# Altium project SharkPup.PrjPcb
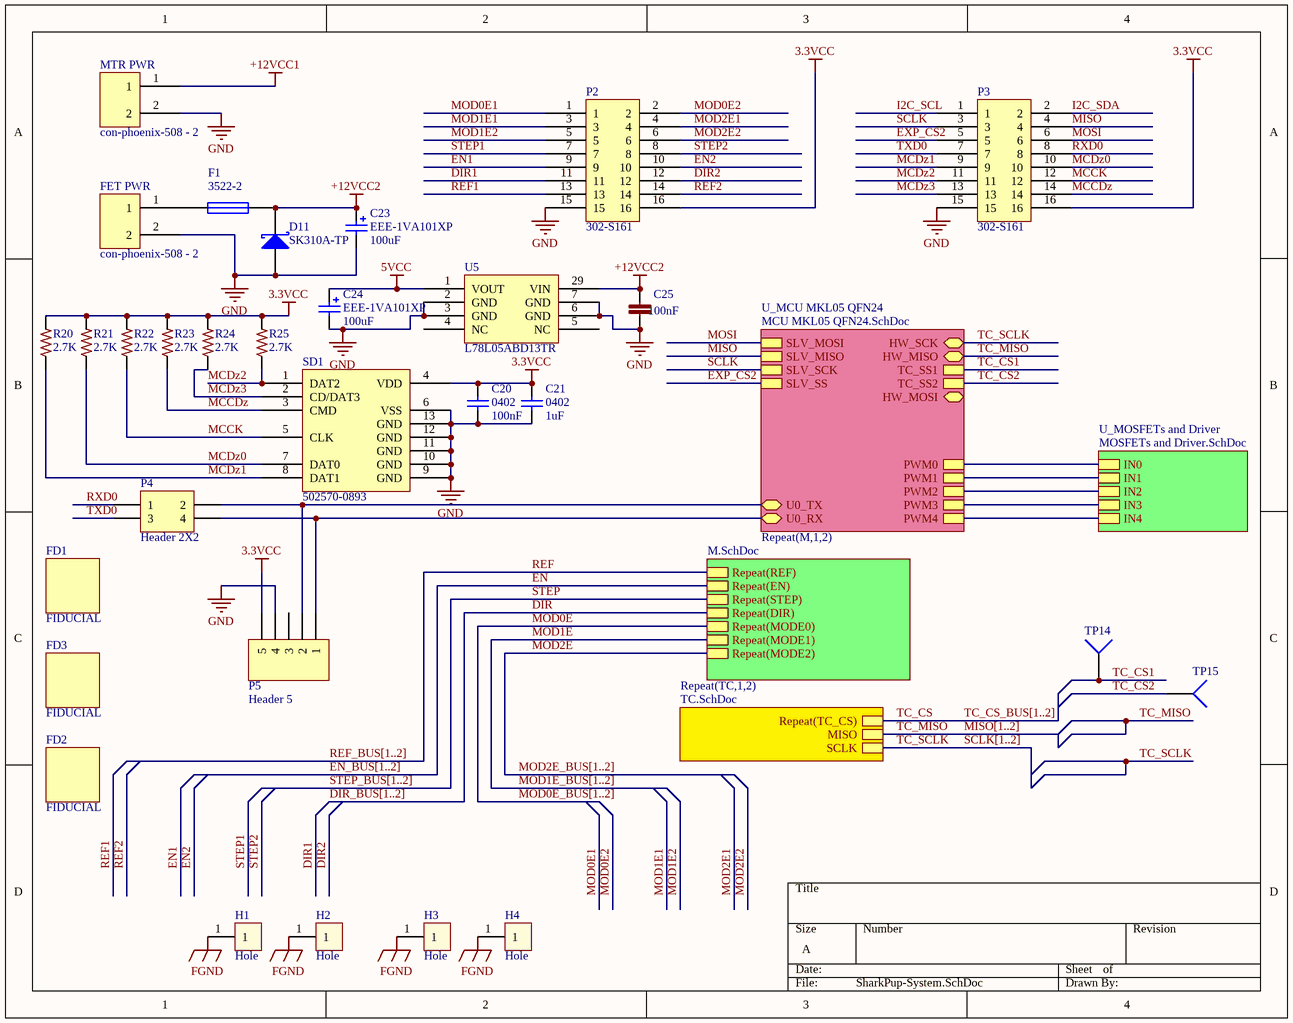
[diagram p0: SharkPup-System.SchDoc]
5 sheets, 136 parts. Net scope: hierarchical (ports join the sheet entries above them; power ports are global).
Sheets:
  SharkPup-System.SchDoc
    M1 = M.SchDoc
    M2 = M.SchDoc
    TC1 = TC.SchDoc
    TC2 = TC.SchDoc
    U_MOSFETs and Driver = MOSFETs and Driver.SchDoc
    U_MCU MKL05 QFN24 = MCU MKL05 QFN24.SchDoc

## Sheet SharkPup-System.SchDoc
size A

### Parts
C20  value 100nF  [C0402]  (hidden comment: 0402)
C21  value 1uF  [C0402]  (hidden comment: 0402)
C23  EEE-1VA101XP  value 100uF  [EEE-1VA101XP]
C24  EEE-1VA101XP  value 100uF  [EEE-1VA101XP]
C25  100nF  [C0603]
D11  SK310A-TP  [SK310A-TP]
F1  3522-2  [3522-2 - WAVE SOLDER]
FD1  FIDUCIAL  [FIDUCIAL-1X2]
FD2  FIDUCIAL  [FIDUCIAL-1X2]
FD3  FIDUCIAL  [FIDUCIAL-1X2]
FET_PWR  con-phoenix-508 - 2  [MSTBV2 - duplicate]
H1  Hole  [Wave_hole_3x7-singleSided]  (no BOM)
H2  Hole  [Wave_hole_3x7-singleSided]  (no BOM)
H3  Hole  [Wave_hole_3x7-singleSided]  (no BOM)
H4  Hole  [Wave_hole_3x7-singleSided]  (no BOM)
MTR_PWR  con-phoenix-508 - 2  [MSTBV2 - duplicate]
P2  302-S161  [302-S161]
P3  302-S161  [302-S161]
P4  Header 2X2  [HDR2X2]
P5  Header 5  [HDR1X5]
R20  2.7K  [R0402]
R21  2.7K  [R0402]
R22  2.7K  [R0402]
R23  2.7K  [R0402]
R24  2.7K  [R0402]
R25  2.7K  [R0402]
SD1  502570-0893  [502570-0893 - Molex SD]
TP14  TP4  [TP-2]  (value not drawn)
TP15  TP4  [TP-2]  (value not drawn)
U5  L78L05ABD13TR  [L78L05ABD13TR]

### Sub-sheets
Repeat(M,1,2) = M.SchDoc: Repeat(REF), Repeat(EN), Repeat(STEP), Repeat(DIR), Repeat(MODE0), Repeat(MODE1), Repeat(MODE2)
Repeat(TC,1,2) = TC.SchDoc: SCLK, MISO, Repeat(TC_CS)
U_MCU MKL05 QFN24 = MCU MKL05 QFN24.SchDoc: TC_SS1, TC_SS2, SLV_MOSI, SLV_MISO, SLV_SCK, SLV_SS, PWM4, PWM3, PWM2, PWM1, PWM0, HW_MISO, HW_MOSI, HW_SCK, U0_TX, U0_RX
U_MOSFETs and Driver = MOSFETs and Driver.SchDoc: IN0, IN1, IN2, IN3, IN4

### Nets
3.3VCC: C20.2 C21.2 P2.16 P3.16 P5.5 R20.2 R21.2 R22.2 R23.2 R24.2 R25.2 SD1.4(VDD)
5VCC: C24.1 U5.1(VOUT)
+12VCC1: MTR_PWR.1
+12VCC2: C23.1 C25.1 D11.2(K) F1.2 U5.29(VIN)
FGND: H1.1 H2.1 H3.1 H4.1
GND: C20.1 C21.1 C23.2 C24.2 C25.2 D11.1(A) FET_PWR.2 MTR_PWR.2 P2.15 P3.15 P5.4 SD1.6(VSS) SD1.9(GND) SD1.10(GND) SD1.11(GND) SD1.12(GND) SD1.13(GND) U5.2(GND) U5.3(GND) U5.6(GND) U5.7(GND)
DIR: sheet Repeat(M,1,2)/Repeat(DIR)
DIR1: P2.11
DIR2: P2.12
EN: sheet Repeat(M,1,2)/Repeat(EN)
EN1: P2.9
EN2: P2.10
EXP_CS2: P3.5 ; sheet U_MCU MKL05 QFN24/SLV_SS
I2C_SCL: P3.1
I2C_SDA: P3.2
MCCDz: P3.14 R23.1 SD1.3(CMD)
MCCK: P3.12 R22.1 SD1.5(CLK)
MCDz0: P3.10 R21.1 SD1.7(DAT0)
MCDz1: P3.9 R20.1 SD1.8(DAT1)
MCDz2: P3.11 R25.1 SD1.1(DAT2)
MCDz3: P3.13 R24.1 SD1.2(CD/DAT3)
MISO: P3.4 ; sheet U_MCU MKL05 QFN24/SLV_MISO
MOD0E: sheet Repeat(M,1,2)/Repeat(MODE0)
MOD0E1: P2.1
MOD0E2: P2.2
MOD1E: sheet Repeat(M,1,2)/Repeat(MODE1)
MOD1E1: P2.3
MOD1E2: P2.5
MOD2E: sheet Repeat(M,1,2)/Repeat(MODE2)
MOD2E1: P2.4
MOD2E2: P2.6
MOSI: P3.6 ; sheet U_MCU MKL05 QFN24/SLV_MOSI
PWM0: sheet U_MOSFETs and Driver/IN0, sheet U_MCU MKL05 QFN24/PWM0
PWM1: sheet U_MOSFETs and Driver/IN1, sheet U_MCU MKL05 QFN24/PWM1
PWM2: sheet U_MOSFETs and Driver/IN2, sheet U_MCU MKL05 QFN24/PWM2
PWM3: sheet U_MOSFETs and Driver/IN3, sheet U_MCU MKL05 QFN24/PWM3
PWM4: sheet U_MOSFETs and Driver/IN4, sheet U_MCU MKL05 QFN24/PWM4
REF: sheet Repeat(M,1,2)/Repeat(REF)
REF1: P2.13
REF2: P2.14
RXD0: P3.8 P4.1
SCLK: P3.3 ; sheet U_MCU MKL05 QFN24/SLV_SCK
STEP: sheet Repeat(M,1,2)/Repeat(STEP)
STEP1: P2.7
STEP2: P2.8
TC_CS: sheet Repeat(TC,1,2)/Repeat(TC_CS)
TC_CS1: TP14.1 ; sheet U_MCU MKL05 QFN24/TC_SS1
TC_CS2: TP15.1 ; sheet U_MCU MKL05 QFN24/TC_SS2
TC_MISO: sheet Repeat(TC,1,2)/MISO, sheet U_MCU MKL05 QFN24/HW_MISO
TC_SCLK: sheet Repeat(TC,1,2)/SCLK, sheet U_MCU MKL05 QFN24/HW_SCK
TXD0: P3.7 P4.3
NetF1_1: F1.1 FET_PWR.1
NetP4_2: P4.2 P5.2 ; sheet U_MCU MKL05 QFN24/U0_TX
NetP4_4: P4.4 P5.1 ; sheet U_MCU MKL05 QFN24/U0_RX

Not connected (* = marked no-connect by the designer): P5 3; U5 4(NC) 5(NC) 23(NC)

### Buses and harness runs
bus DIR_BUS[1..2]
bus EN_BUS[1..2]
bus MISO[1..2]
bus MOD0E_BUS[1..2]
bus MOD1E_BUS[1..2]
bus MOD2E_BUS[1..2]
bus REF_BUS[1..2]
bus SCLK[1..2]
bus STEP_BUS[1..2]
bus TC_CS_BUS[1..2]

### Library data of the parts
C20 = GRM155R71C104KA88D: CAP CER 0.1UF (100nF) 16V 10% X7R 0402; MFR: Murata; Part Description: CAP CER 0.1UF 16V 10% X7R 0402; Published: 10 - Dec - 2014; LatestRevisionDate: 10 - Dec - 2014; LatestRevisionNote: Ultimachine Footprint Added; Publisher: Ultimachine; Component Type: Chip Capacitor; MFR Part #: GRM155R71C104KA88D; Mounting Type: SMT 0402; Datasheet: http://psearch.murata.com/capacitor/product/GRM155R71C104KA88%23.pdf; Height: 0.5 ±0.05mm; Tolerance: 10%; Voltage: 16v; PackageReference: 0402
C21 = GRM155R60J105KE19D: CAP CER 1UF 6.3V 10% X5R 0402; MFR: Murata; Voltage: 6.3VDC; Published: 10 - Dec - 2014; LatestRevisionDate: 10 - Dec - 2014; LatestRevisionNote: Ultimachine Footprint Added; Publisher: Ultimachine; Component Type: Chip Capacitor; MFR Part #: GRM155R60J105KE19D; Part Description: CAP CER 1UF 6.3V 10% X5R 0402; Mounting Type: SMT 0402; Datasheet: http://psearch.murata.com/capacitor/product/GRM155R60J105KE19%23.pdf; Height: 0.55mm; Tolerance: 10%; PackageReference: 0402
C23 C24 = EEE-1VA101XP: CAP ALUM 100UF 35V 20% SMD; Manufacture: Panasonic; Digikey Part #: PCE3951CT-ND; Price: $0.63; Mount Type: SMT Panasonic VS D Series; Status: Active; Height: 7.70mm; Datasheet: http://industrial.panasonic.com/www-cgi/jvcr13pz.cgi?E+PZ+3+ABA0002+EEE1VA101XP+7+WW; Manufacture Part #: EEE-1VA101XP
C25 = C0603C104K5RACTU: CAP CER 0603 100nF 50V 10% X7R; LastRevisionNote: ImportComponents; Published: 23-Apr-2014; Publisher: UltiMachine; LastRevisionDate: 23-Apr-2014; ManufacturerPartNumber: C0603C104K5RACTU; VALUE: 100nF
D11 = D Schottky: Schottky Diode; Published: 8-Jun-2000; LatestRevisionDate: 17-Jul-2002; LatestRevisionNote: Re-released for DXP Platform.; PackageReference: SMB; Publisher: Altium Limited; PackageDescription: DO-214-AA/SMB; 2 C-Bend Leads; Body 5.3 x 3.6 mm, inc. leads (LxW); Code_JEDEC: DO-214-AA
F1 = Fuse 1: Fuse; Published: 8-Jun-2000; LatestRevisionDate: 17-Jul-2002; LatestRevisionNote: Re-released for DXP Platform.; PackageReference: PIN-W2/E2.8; Publisher: Altium Limited; PackageDescription: Thru-Hole; 2 Leads
FET_PWR MTR_PWR = con-phoenix-508_2
P2 P3 = 302-S161: 16 Pos 2.54mm Pin Connector Shrouded; Manufacture: On Shore Technology Inc; Value: 2.54mm Pitch Spacing; Manufature Part #: 302-S161; Datasheet: http://www.on-shore.com/sites/default/files/manuals/302-sxxx.pdf; Digikey Part #: ED10522-ND; Pin Count: 16; Type: Throughhole connector; Mount Type: Through hole; Price: $0.40; Height: 9.1mm
P4 = Header 2X2: Header, 2-Pin, Dual row; LatestRevisionDate: 17-Jul-2002; LatestRevisionNote: Re-released for DXP Platform.; Publisher: Altium Limited
P5 = Header 5: Header, 5-Pin; LatestRevisionDate: 17-Jul-2002; LatestRevisionNote: Re-released for DXP Platform.; Publisher: Altium Limited
R20-R25 = ERJ-2RKF2701X: RES SMD 2.7K OHM 1% 1/10W 0402; Manufacturer: Panasonic; ManufacturerPartNumber: ERJ2GEJ105X; LastRevisionNote: ImportComponents; Published: 23-Apr-2014; Publisher: Adam; LastRevisionDate: 23-Apr-2014; VALUE: 2.7K
SD1 = 502570-0893: microSD 502570-0893 Molex Part
TP14 TP15 = Socket: LatestRevisionDate: 17-Jul-2002; LatestRevisionNote: Re-released for DXP Platform.; Publisher: Altium Limited
U5 = L78L05ABD13TR: IC REG LDO 5V 0.1A 8SO; Manufacturer: ST Microelectronics; Mountining Type: SOIC8; Voltage: 30V; Cost (1000 qty): $0.44; Manfacture Part Number: L78L05ABD13TR; Status: In-Production; Pins: 28 Pins and one Exposed Pad; Datasheet: http://www.st.com/web/en/resource/technical/document/datasheet/CD00000446.pdf; Height: 1.2mm; Tolerance: N/A; Type: 5V 100mA LDO; Lead Free: YES

## Sheet M.SchDoc
size A
Used 2 times, as channels M1, M2. Parts and nets are listed once, with the designators drawn on the sheet.
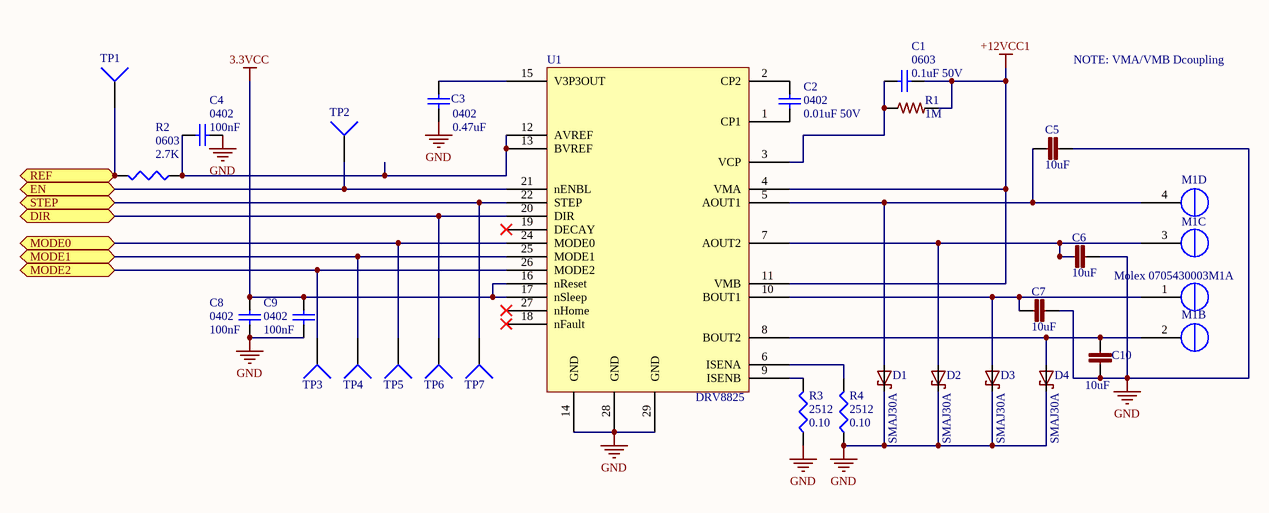
[diagram p1: M.SchDoc]

### Parts
C1  0603  value 0.1uF 50V  [1608[0603]]
C2  value 0.01uF 50V  [C0402]  (hidden comment: 0402)
C3  value 0.47uF  [C0402]  (hidden comment: 0402)
C4  value 100nF  [C0402]  (hidden comment: 0402)
C5  10uF  [C0603]
C6  10uF  [C0603]
C7  10uF  [C0603]
C8  value 100nF  [C0402]  (hidden comment: 0402)
C9  value 100nF  [C0402]  (hidden comment: 0402)
C10  10uF  [C0603]
D1  SMAJ30A  [SMA-SM]
D2  SMAJ30A  [SMA-SM]
D3  SMAJ30A  [SMA-SM]
D4  SMAJ30A  [SMA-SM]
M1  Molex 0705430003  [4POL254]  (parts A,B,C,D of 4)
R1  1M  [R0402]
R2  0603  value 2.7K  [J1-0603]
R3  2512  value 0.10  [Resistor2512]
R4  2512  value 0.10  [Resistor2512]
TP1  TP4  [TP-2]  (value not drawn)
TP2  TP4  [TP-2]  (value not drawn)
TP3  TP4  [TP-2]  (value not drawn)
TP4  TP4  [TP-2]  (value not drawn)
TP5  TP4  [TP-2]  (value not drawn)
TP6  TP4  [TP-2]  (value not drawn)
TP7  TP4  [TP-2]  (value not drawn)
U1  DRV8825  [DRV8825]

### Ports
DIR, EN, MODE0, MODE1, MODE2, REF, STEP

### Nets
3.3VCC: C8.2 C9.2 U1.16(nReset) U1.17(nSleep)
+12VCC1: C1.1 R1.2 U1.4(VMA) U1.11(VMB)
GND: C3.1 C4.1 C5.2 C6.2 C7.2 C8.1 C9.1 C10.2 D1.C D2.C D3.C D4.C R3.1 R4.1 U1.14(GND) U1.28(GND) U1.29(GND)
DIR: TP6.1 U1.20(DIR) ; port DIR
EN: TP2.1 U1.21(nENBL) ; port EN
MODE0: TP5.1 U1.24(MODE0) ; port MODE0
MODE1: TP4.1 U1.25(MODE1) ; port MODE1
MODE2: TP3.1 U1.26(MODE2) ; port MODE2
REF: R2.2 TP1.1 ; port REF
STEP: TP7.1 U1.22(STEP) ; port STEP
NetC1_2: C1.2 R1.1 U1.3(VCP)
NetC2_1: C2.1 U1.1(CP1)
NetC2_2: C2.2 U1.2(CP2)
NetC3_2: C3.2 U1.15(V3P3OUT)
NetC4_2: C4.2 R2.1 U1.12(AVREF) U1.13(BVREF)
NetC5_1: C5.1 D1.A M1.4(OUT1B) U1.5(AOUT1)
NetC6_1: C6.1 D2.A M1.3(OUT1A) U1.7(AOUT2)
NetC7_1: C7.1 D3.A M1.1(OUT2B) U1.10(BOUT1)
NetC10_1: C10.1 D4.A M1.2(OUT2A) U1.8(BOUT2)
NetR3_2: R3.2 U1.9(ISENB)
NetR4_2: R4.2 U1.6(ISENA)

Not connected (* = marked no-connect by the designer): U1 18(nFault)* 19(DECAY)* 23(NC) 27(nHome)*

### Channels
M1: designators end in _M1; ports DIR=DIR1 EN=EN1 MODE0=MOD0E1 MODE1=MOD1E1 MODE2=MOD2E1 REF=REF1 STEP=STEP1
M2: designators end in _M2; ports DIR=DIR2 EN=EN2 MODE0=MOD0E2 MODE1=MOD1E2 MODE2=MOD2E2 REF=REF2 STEP=STEP2

### Notes on the sheet
- NOTE: VMA/VMB Dcoupling

### Library data of the parts
C1 = Cap Semi: Capacitor (Semiconductor SIM Model); Published: 8-Jun-2000; LatestRevisionDate: 29-May-2009; LatestRevisionNote: IPC-7351 Footprint Added.; PackageReference: C1206; Publisher: Altium Limited; PackageDescription: Chip Capacitor
C2 = GRM155R71H103JA88D: CAP CER 10000PF 50V X7R 0402; MFR: Murata; Tolerance: 10%; Voltage: 6.3VDC; Published: 10 - Dec - 2014; LatestRevisionDate: 10 - Dec - 2014; LatestRevisionNote: Ultimachine Footprint Added; Publisher: Ultimachine; Component Type: Chip Capacitor; MFR Part #: GRM155R71H103JA88D; Part Description: CAP CER 10000PF 50V X7R 0402; Mounting Type: SMT 0402; Datasheet: http://search.murata.co.jp/Ceramy/image/img/A01X/G101/ENG/GRM155R71H103JA88-01.pdf; Height: 0.5 ±0.05mm; Digikey #: 490-7763-1-ND; PackageReference: 0402
C3 = GRM155R60J474KE19D: 0.47uF 6.3v C0402 - GRM155R60J474KE19D; MFR: Murata; Part Description: CAP CER 0.47UF 6.3V 10% X5R 0402; Tolerance: 10%; Voltage: 6.3VDC; Published: 10 - Dec - 2014; LatestRevisionDate: 10 - Dec - 2014; LatestRevisionNote: Ultimachine Footprint Added; Publisher: Ultimachine; Component Type: Chip Capacitor; MFR Part #: GRM155R60J474KE19D; Mounting Type: SMT 0402; Datasheet: http://search.murata.co.jp/Ceramy/image/img/A01X/G101/ENG/GRM155R60J474KE19-01.pdf; Height: 0.5 ±0.05mm; PackageReference: 0402
C4 C8 C9 = 100nF C0402 - GRM155R71C104KA88D: Capacitor (Semiconductor SIM Model); MFR: Murata; Part Description: CAP CER 0.1UF 16V 10% X7R 0402; Tolerance: 10%; Voltage: 16v; Published: 10 - Dec - 2014; LatestRevisionDate: 10 - Dec - 2014; LatestRevisionNote: Ultimachine Footprint Added; Publisher: Ultimachine; Component Type: Chip Capacitor; MFR Part #: GRM155R71C104KA88D; Mounting Type: SMT 0402; Datasheet: http://psearch.murata.com/capacitor/product/GRM155R71C104KA88%23.pdf; Height: 0.5 ±0.05mm; PackageReference: 0402
C5-C7 C10 = CC0603ZRY5V6BB105: CAP CER 0603 1uF 10V Y5V; LastRevisionNote: ImportComponents; Published: 23-Apr-2014; Publisher: UltiMachine; LastRevisionDate: 23-Apr-2014; ManufacturerPartNumber: CC0603ZRY5V6BB105; VALUE: 10uF
D1-D4 = SMAJ30A: DIODE TVS 30V SMA; LastRevisionNote: ImportComponents; Published: 23-Apr-2014; Publisher: UltiMachine; LastRevisionDate: 23-Apr-2014; ManufacturerPartNumber: SMAJ30A
M1 = Molex 0705430003 Alt: Molex 4 Pin Clip Connector
R1 = ERJ2GEJ105X: RES 0402 1M 100mW 5%; LastRevisionNote: ImportComponents; Published: 23-Apr-2014; Publisher: UltiMachine; LastRevisionDate: 23-Apr-2014; ManufacturerPartNumber: ERJ2GEJ105X; VALUE: 1M
R2-R4 = Res3: Resistor; Published: 8-Jun-2000; LatestRevisionDate: 29-May-2009; LatestRevisionNote: IPC-7351 Footprint Added.; PackageReference: J1-0603; Publisher: Altium Limited; PackageDescription: Chip Resistor
TP1-TP7 = Socket: LatestRevisionDate: 17-Jul-2002; LatestRevisionNote: Re-released for DXP Platform.; Publisher: Altium Limited
U1 = DRV8825: DRV8825 Ti Stepper Driver

## Sheet TC.SchDoc
size A
Used 2 times, as channels TC1, TC2. Parts and nets are listed once, with the designators drawn on the sheet.
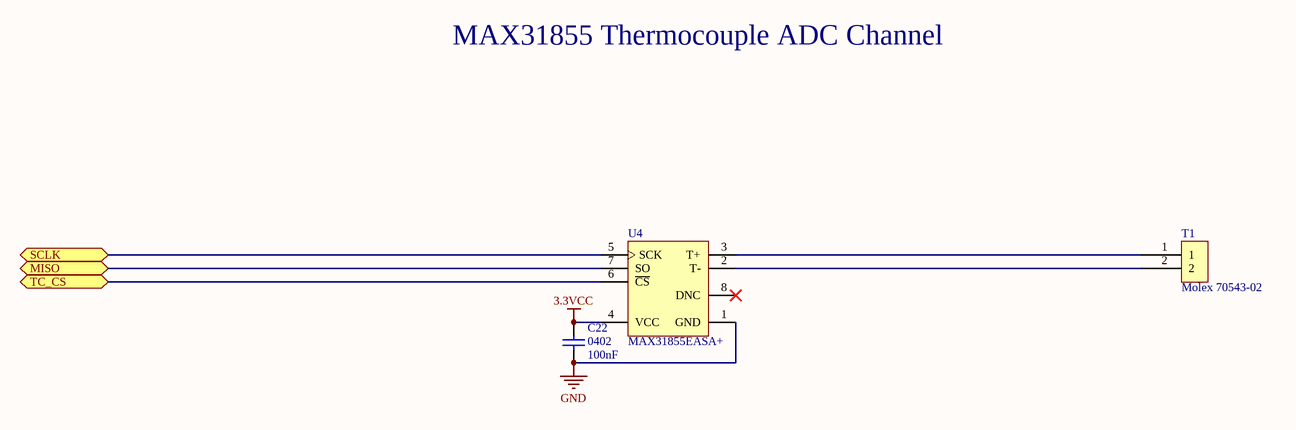
[diagram p2: TC.SchDoc]

### Parts
C22  value 100nF  [C0402]  (hidden comment: 0402)
T1  Molex 70543-02  [70543-02]
U4  MAX31855EASA+  [MAXM-S8+4_N]

### Ports
MISO, SCLK, TC_CS

### Nets
3.3VCC: C22.2 U4.4(VCC)
GND: C22.1 U4.1(GND)
MISO: U4.7(SO) ; port MISO
SCLK: U4.5(SCK) ; port SCLK
TC_CS: U4.6(~{CS}) ; port TC_CS
NetT1_1: T1.1 U4.3(T+)
NetT1_2: T1.2 U4.2(T-)

Not connected (* = marked no-connect by the designer): U4 8(DNC)*

### Channels
TC1: designators end in _TC1; ports MISO=TC_MISO SCLK=TC_SCLK TC_CS=TC_CS1
TC2: designators end in _TC2; ports MISO=TC_MISO SCLK=TC_SCLK TC_CS=TC_CS2

### Notes on the sheet
- MAX31855 Thermocouple ADC Channel

### Library data of the parts
C22 = 100nF C0402 - GRM155R71C104KA88D: as C4 on sheet M; Published: 10 - Dec - 2014; LatestRevisionDate: 10 - Dec - 2014; LatestRevisionNote: Ultimachine Footprint Added; Publisher: Ultimachine; Component Type: Chip Capacitor; MFR Part #: GRM155R71C104KA88D; Mounting Type: SMT 0402; Datasheet: http://psearch.murata.com/capacitor/product/GRM155R71C104KA88%23.pdf; Height: 0.5 ±0.05mm; PackageReference: 0402
U4 = MAX31855EASA+: Cold Junction Compensated Thermocouple to Digital Converter, 14 Bits Temperature Resolution, -40 to 125 degC, 8-Pin SOIC (S8+4), Pb-Free; Functions: Thermocouple-to-Digital Converter; Interface: SPI; Parasite Pwr.: No; DatasheetVersion: Rev. 2; PackageVersion: Rev. D, 10/2012; PackageReference: S8+4; PackageDescription: 8-Pin Small-Outline IC, Narrow, Body 3.9 x 4.9 mm, Pitch 1.27 mm; Supplier 1: Digi-Key; Supplier Part Number 1: MAX31855EASA+-ND; Supplier 2: Mouser; Supplier Part Number 2: 700-MAX31855EASA+; Generic Part Number: MAX31855; Mounting Technology: Surface Mount; Code_JEDEC: MS-012; PartNumber: MAX31855EASA+; ComponentLink1Description: Manufacturer URL; ComponentLink1URL: http://www.maximintegrated.com/; ComponentLink2Description: Datasheet; ComponentLink2URL: http://datasheets.maximintegrated.com/en/ds/MAX31855.pdf; ComponentLink3Description: Package Specification; ComponentLink3URL: http://pdfserv.maximintegrated.com/package_dwgs/21-0041.PDF

## Sheet MOSFETs and Driver.SchDoc
size B
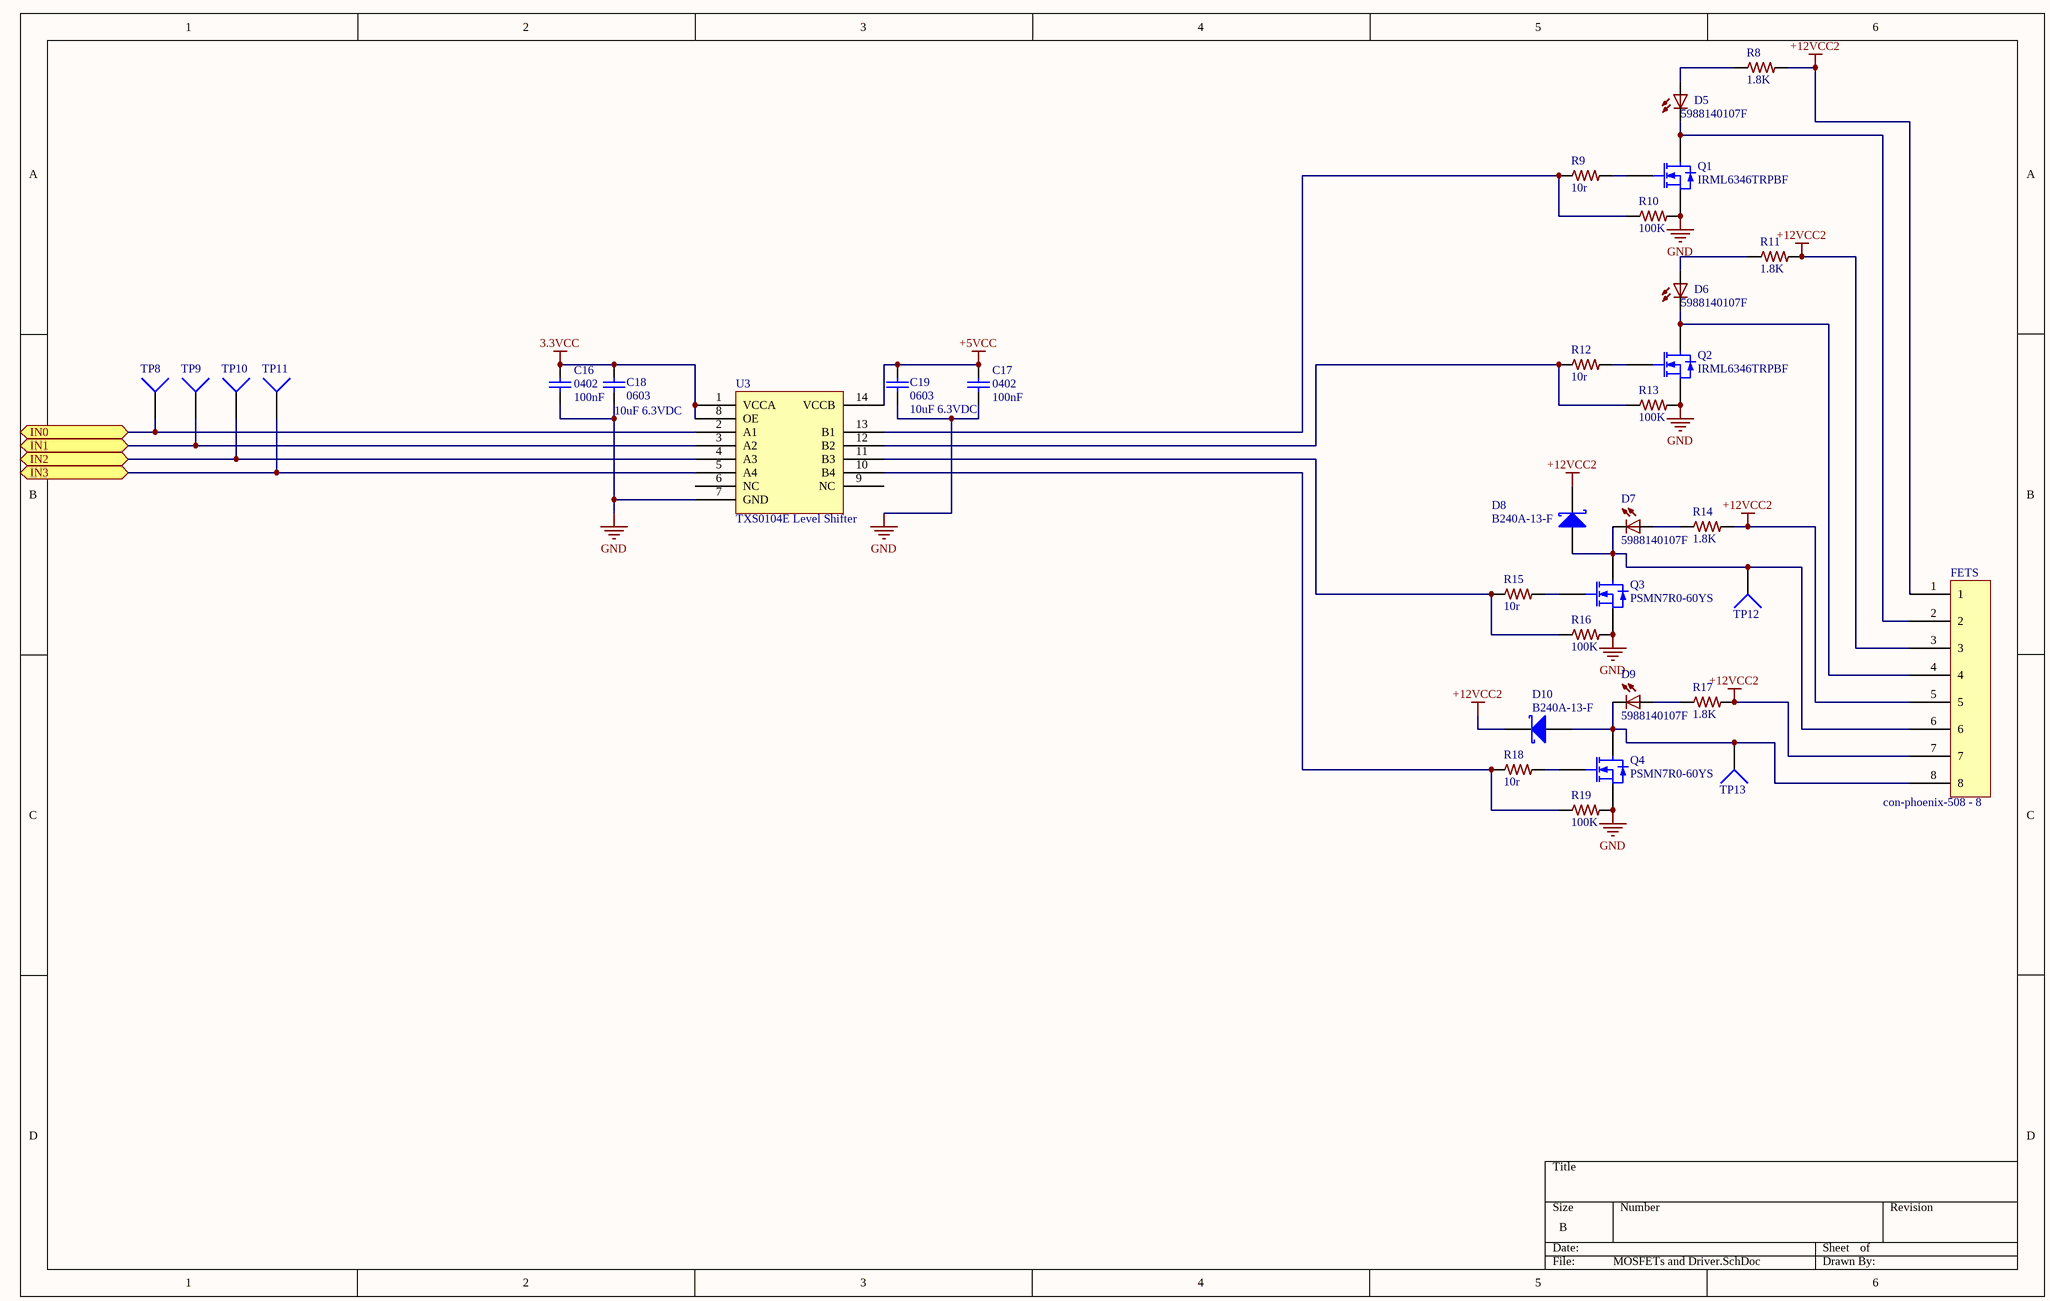
[diagram p3: MOSFETs and Driver.SchDoc]

### Parts
C16  value 100nF  [C0402]  (hidden comment: 0402)
C17  value 100nF  [C0402]  (hidden comment: 0402)
C18  0603  value 10uF 6.3VDC  [C0603]
C19  0603  value 10uF 6.3VDC  [C0603]
D5  5988140107F  [LED2012120]
D6  5988140107F  [LED2012120]
D7  5988140107F  [LED2012120]
D8  B240A-13-F  [SK310A-TP]
D9  5988140107F  [LED2012120]
D10  B240A-13-F  [SK310A-TP]
FETS  con-phoenix-508 - 8  [MSTBV8]
Q1  IRML6346TRPBF  [IRLML6346]
Q2  IRML6346TRPBF  [IRLML6346]
Q3  PSMN7R0-60YS  [PSMN7R0-60YS]
Q4  PSMN7R0-60YS  [PSMN7R0-60YS]
R8  1.8K  [R0603]
R9  10r  [R0603]
R10  100K  [R0603]
R11  1.8K  [R0603]
R12  10r  [R0603]
R13  100K  [R0603]
R14  1.8K  [R0603]
R15  10r  [R0603]
R16  100K  [R0603]
R17  1.8K  [R0603]
R18  10r  [R0603]
R19  100K  [R0603]
TP8  TP4  [TP-2]  (value not drawn)
TP9  TP4  [TP-2]  (value not drawn)
TP10  TP4  [TP-2]  (value not drawn)
TP11  TP4  [TP-2]  (value not drawn)
TP12  TP4  [TP-2]  (value not drawn)
TP13  TP4  [TP-2]  (value not drawn)
U3  TXS0104E Level Shifter  [RGY  (S-PVQFN-N14)]

### Ports
IN0, IN1, IN2, IN3

### Nets
3.3VCC: C16.2 C18.2 U3.1(VCCA) U3.8(OE)
+5VCC: C17.2 C19.2 U3.14(VCCB)
+12VCC2: D8.2(K) D10.2(K) FETS.1 FETS.3 FETS.5 FETS.7 R8.2 R11.2 R14.2 R17.2
GND: C16.1 C17.1 C18.1 C19.1 Q1.2(S) Q2.2(S) Q3.1(S) Q3.2(S) Q3.3(S) Q4.1(S) Q4.2(S) Q4.3(S) R10.2 R13.2 R16.2 R19.2 U3.7(GND)
PWM0: TP8.1 U3.2(A1) ; port IN0
PWM1: TP9.1 U3.3(A2) ; port IN1
PWM2: TP10.1 U3.4(A3) ; port IN2
PWM3: TP11.1 U3.5(A4) ; port IN3
NetD5_A: D5.A R8.1
NetD5_C: D5.C FETS.2 Q1.3(D)
NetD6_A: D6.A R11.1
NetD6_C: D6.C FETS.4 Q2.3(D)
NetD7_A: D7.A R14.1
NetD7_C: D7.C D8.1(A) FETS.6 Q3.5(D) TP12.1
NetD9_A: D9.A R17.1
NetD9_C: D9.C D10.1(A) FETS.8 Q4.5(D) TP13.1
NetQ1_1: Q1.1(G) R9.2
NetQ2_1: Q2.1(G) R12.2
NetQ3_4: Q3.4(G) R15.2
NetQ4_4: Q4.4(G) R18.2
NetR9_1: R9.1 R10.1 U3.13(B1)
NetR12_1: R12.1 R13.1 U3.12(B2)
NetR15_1: R15.1 R16.1 U3.11(B3)
NetR18_1: R18.1 R19.1 U3.10(B4)

Not connected (* = marked no-connect by the designer): U3 6(NC) 9(NC)

### Library data of the parts
C16 C17 = GRM155R71C104KA88D: as C20 on sheet SharkPup-System; Published: 10 - Dec - 2014; LatestRevisionDate: 10 - Dec - 2014; LatestRevisionNote: Ultimachine Footprint Added; Publisher: Ultimachine; Component Type: Chip Capacitor; MFR Part #: GRM155R71C104KA88D; Mounting Type: SMT 0402; Datasheet: http://psearch.murata.com/capacitor/product/GRM155R71C104KA88%23.pdf; Height: 0.5 ±0.05mm; Tolerance: 10%; Voltage: 16v; PackageReference: 0402
C18 C19 = C1608JB0J106K080AB: CAP CER 10UF 6.3V 10% JB 0603; MFR: TDK; Voltage: 6.3VDC; Published: 10 - Dec - 2014; LatestRevisionDate: 10 - Dec - 2014; Component Type: Chip Capacitor; MFR Part #: C1608JB0J106K080AB; Part Description: CAP CER 10UF 6.3V 10% JB 0603; Mounting Type: SMT 0603; Datasheet: http://www.tdk.com/pdf/TDKMLCCCapRange.pdf; Height: 0.9mm; Tolerance: 10%; Digikey #: 445-11185-1-ND; PackageReference: 0402
D5-D7 D9 = 5988140107F: LED 0805 Yellow; LastRevisionNote: ImportComponents; Published: 23-Apr-2014; Publisher: UltiMachine; LastRevisionDate: 23-Apr-2014; VALUE: 5988140107F
D8 D10 = D Schottky: Schottky Diode; Published: 8-Jun-2000; LatestRevisionDate: 17-Jul-2002; LatestRevisionNote: Re-released for DXP Platform.; PackageReference: SMB; Publisher: Altium Limited; PackageDescription: DO-214-AA/SMB; 2 C-Bend Leads; Body 5.3 x 3.6 mm, inc. leads (LxW); Code_JEDEC: DO-214-AA
FETS = con-phoenix-508
Q1 Q2 = IRML6346TRPBF: N-Channel MOSFET; Published: 8-Jun-2000; LatestRevisionDate: 17-Jul-2002; LatestRevisionNote: Re-released for DXP Platform.; PackageVersion: 1995/1996; PackageReference: E3; Publisher: Altium Limited; PackageDescription: TO, Flat Index; 3 In-Line, Axial Leads; Body Dia. 4.6mm; Lead Dia. 0.5 mm (max)
Q3 Q4 = PSMN7R0-60YS: N-Channel MOSFET; Published: 8-Jun-2000; LatestRevisionDate: 17-Jul-2002; LatestRevisionNote: Re-released for DXP Platform.; PackageVersion: 1995/1996; PackageReference: E3; Publisher: Altium Limited; PackageDescription: TO, Flat Index; 3 In-Line, Axial Leads; Body Dia. 4.6mm; Lead Dia. 0.5 mm (max)
R8 R11 R14 R17 = RC0603JR-071K8L: RES 0603 1.8K 100mW 5%; LastRevisionNote: ImportComponents; Published: 23-Apr-2014; Publisher: UltiMachine; LastRevisionDate: 23-Apr-2014; ManufacturerPartNumber: RC0603JR-071K8L; VALUE: 1.8K
R9 R12 R15 R18 = CRCW060310R0FKEA: RES 0603 10r 100mW 1%; LastRevisionNote: ImportComponents; Published: 23-Apr-2014; Publisher: UltiMachine; LastRevisionDate: 23-Apr-2014; ManufacturerPartNumber: CRCW060310R0FKEA; VALUE: 10r
R10 R13 R16 R19 = RC0603FR-07100KL: RES 100K OHM 1/10W 1% 0603 SMD; LastRevisionNote: ImportComponents; Published: 23-Apr-2014; Publisher: UltiMachine; LastRevisionDate: 23-Apr-2014; ManufacturerPartNumber: RC0603FR-07100KL; VALUE: 100K
TP8-TP13 = Socket: LatestRevisionDate: 17-Jul-2002; LatestRevisionNote: Re-released for DXP Platform.; Publisher: Altium Limited
U3 = TXS0104E: TXS0104E - Bidriectional Opendrain/pushpull level shift

## Sheet MCU MKL05 QFN24.SchDoc
size A
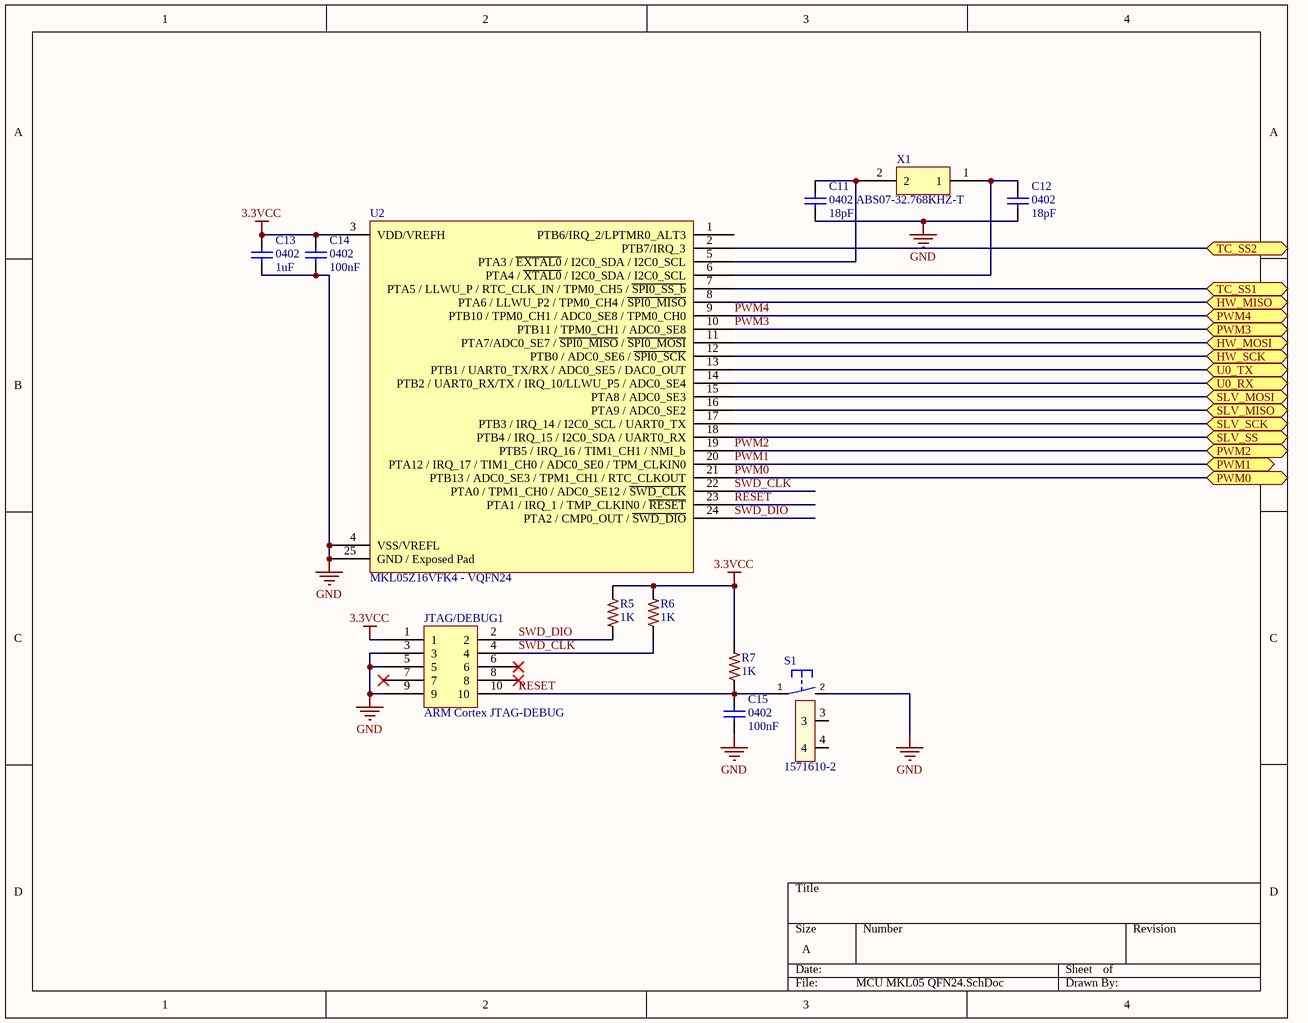
[diagram p4: MCU MKL05 QFN24.SchDoc]

### Parts
C11  value 18pF  [C0402]  (hidden comment: 0402)
C12  value 18pF  [C0402]  (hidden comment: 0402)
C13  value 1uF  [C0402]  (hidden comment: 0402)
C14  value 100nF  [C0402]  (hidden comment: 0402)
C15  value 100nF  [C0402]  (hidden comment: 0402)
JTAG/DEBUG1  ARM Cortex JTAG-DEBUG  [FTSH-105-XX-X-DV]
R5  1K  [R0603]
R6  1K  [R0603]
R7  1K  [R0603]
S1  1571610-2  [B3F-31XX]
U2  MKL05Z16VFK4 - VQFN24  [98ASA00474D]
X1  ABS07-32.768KHZ-T  [ABS07-32.768KHZ-T]

### Ports
HW_MISO, HW_MOSI, HW_SCK, PWM0, PWM1, PWM2, PWM3, PWM4, SLV_MISO, SLV_MOSI, SLV_SCK, SLV_SS, TC_SS1, TC_SS2, U0_RX, U0_TX

### Nets
3.3VCC: C13.2 C14.2 JTAG/DEBUG1.1 R5.1 R6.2 R7.2 U2.3(VDD/VREFH)
GND: C11.1 C12.1 C13.1 C14.1 C15.1 JTAG/DEBUG1.3 JTAG/DEBUG1.5 JTAG/DEBUG1.9 S1.2(S) U2.4(VSS/VREFL) U2.25(GND_/_Exposed_Pad)
EXP_CS2: U2.18(PTB4_/_IRQ_15_/_I2C0_SDA_/_UART0_RX) ; port SLV_SS
MISO: U2.16(PTA9_/_ADC0_SE2) ; port SLV_MISO
MOSI: U2.15(PTA8_/_ADC0_SE3) ; port SLV_MOSI
PWM0: U2.21(PTB13_/_ADC0_SE3_/_TPM1_CH1_/_RTC_CLKOUT) ; port PWM0
PWM1: U2.20(PTA12_/_IRQ_17_/_TIM1_CH0_/_ADC0_SE0_/_TPM_CLKIN0) ; port PWM1
PWM2: U2.19(PTB5_/_IRQ_16_/_TIM1_CH1_/_NMI_b) ; port PWM2
PWM3: U2.10(PTB11_/_TPM0_CH1_/_ADC0_SE8) ; port PWM3
PWM4: U2.9(PTB10_/_TPM0_CH1_/_ADC0_SE8_/_TPM0_CH0) ; port PWM4
RESET: C15.2 JTAG/DEBUG1.10 R7.1 S1.1(P) U2.23(PTA1_/_IRQ_1_/_TMP_CLKIN0_/_~{RESET})
SCLK: U2.17(PTB3_/_IRQ_14_/_I2C0_SCL_/_UART0_TX) ; port SLV_SCK
SWD_CLK: JTAG/DEBUG1.4 R6.1 U2.22(PTA0_/_TPM1_CH0_/_ADC0_SE12_/_~{SWD_CLK})
SWD_DIO: JTAG/DEBUG1.2 R5.2 U2.24(PTA2_/_CMP0_OUT_/_~{SWD_DIO})
TC_CS1: U2.7(PTA5_/_LLWU_P_/_RTC_CLK_IN_/_TPM0_CH5_/_~{SPI0_SS_b}) ; port TC_SS1
TC_CS2: U2.2(PTB7/IRQ_3) ; port TC_SS2
TC_MISO: U2.8(PTA6_/_LLWU_P2_/_TPM0_CH4_/_~{SPI0_MISO}) ; port HW_MISO
TC_SCLK: U2.12(PTB0_/_ADC0_SE6_/_~{SPI0_SCK}) ; port HW_SCK
NetC11_2: C11.2 U2.5(PTA3_/_~{EXTAL0}_/_I2C0_SDA_/_I2C0_SCL) X1.2
NetC12_2: C12.2 U2.6(PTA4_/_~{XTAL0}_/_I2C0_SDA_/_I2C0_SCL) X1.1
NetP4_2: U2.13(PTB1_/_UART0_TX/RX_/_ADC0_SE5_/_DAC0_OUT) ; port U0_TX
NetP4_4: U2.14(PTB2_/_UART0_RX/TX_/_IRQ_10/LLWU_P5_/_ADC0_SE4) ; port U0_RX
NetU2_11: U2.11(PTA7/ADC0_SE7_/_~{SPI0_MISO}_/_~{SPI0_MOSI}) ; port HW_MOSI

Not connected (* = marked no-connect by the designer): JTAG/DEBUG1 6* 7* 8*; S1 3 4; U2 1(PTB6/IRQ_2/LPTMR0_ALT3)

### Library data of the parts
C11 C12 = CL05C180GB5NNNC: CAP CER 18PF 50V 2% NP0 0402; Manufacturer: Samsung; Published: 10 - Dec - 2014; LatestRevisionDate: 10 - Dec - 2014; LatestRevisionNote: Ultimachine Footprint Added; Publisher: Ultimachine; Component Type: Chip Capacitor; Manufacture Part #: CL05C180GB5NNNC; Part Description: CAP CER 18PF 50V 2% NP0 0402; Mounting Type: SMT 0402; Datasheet: http://www.samsungsem.com/kr/front/downloadcms.do?path=/kr/support/product-search/mlcc/__icsFiles/afieldfile/2014/11/05&fileName=S_CL05C180GB5NNNC.pdf; Height: 0.25 ± 0.15mm; Tolerance: 2%; Voltage: 50V; PackageReference: 0402
C13 = GRM155R60J105KE19D: as C21 on sheet SharkPup-System; Published: 10 - Dec - 2014; LatestRevisionDate: 10 - Dec - 2014; LatestRevisionNote: Ultimachine Footprint Added; Publisher: Ultimachine; Component Type: Chip Capacitor; MFR Part #: GRM155R60J105KE19D; Part Description: CAP CER 1UF 6.3V 10% X5R 0402; Mounting Type: SMT 0402; Datasheet: http://psearch.murata.com/capacitor/product/GRM155R60J105KE19%23.pdf; Height: 0.55mm; Tolerance: 10%; PackageReference: 0402
C14 C15 = GRM155R71C104KA88D: as C20 on sheet SharkPup-System; Published: 10 - Dec - 2014; LatestRevisionDate: 10 - Dec - 2014; LatestRevisionNote: Ultimachine Footprint Added; Publisher: Ultimachine; Component Type: Chip Capacitor; MFR Part #: GRM155R71C104KA88D; Mounting Type: SMT 0402; Datasheet: http://psearch.murata.com/capacitor/product/GRM155R71C104KA88%23.pdf; Height: 0.5 ±0.05mm; Tolerance: 10%; Voltage: 16v; PackageReference: 0402
JTAG/DEBUG1 = ARM Cortex JTAG-DEBUG Header
R5-R7 = ERJ-3EKF1001V: RES 0603 1K 100mW 1%; LastRevisionNote: ImportComponents; Published: 23-Apr-2014; Publisher: UltiMachine; LastRevisionDate: 23-Apr-2014; ManufacturerPartNumber: ERJ-3EKF1001V; VALUE: 1K
S1 = 1571610-2_1: SWTCH Momentary Washable; Manufacturer: Omron; Manufacturer: TE; LastRevisionNote: Import; ComponentLink1URL: http://www.te.com/commerce/DocumentDelivery/DDEController?Action=srchrtrv&DocNm=1571610&DocType=Customer+Drawing&DocLang=English; ComponentLink1Description: Datasheet for B3F-31XX; Published: 23-Apr-2014; Publisher: UltiMachine; LastRevisionDate: 23-Apr-2014; ManufacturerPartNumber: 1571610-2; Supplier 1: Mouser; Supplier Part Number 1: 506-1571610-2
U2 = MKL05Z16VFK4 - 24 Pin VQFN: ARM Cortex M0+
X1 = ABS07-32.768KHZ-T: ABS07-32.768KHZ-T RTC Crystal Oscillator

## Nets that join several sheets
3.3VCC: SharkPup-System (12 pins), M1 (C8_M1.2 C9_M1.2 U1_M1.16 U1_M1.17), M2 (C8_M2.2 C9_M2.2 U1_M2.16 U1_M2.17), TC1 (C22_TC1.2 U4_TC1.4), TC2 (C22_TC2.2 U4_TC2.4), MOSFETs and Driver (C16.2 C18.2 U3.1 U3.8), MCU MKL05 QFN24 (7 pins)
+12VCC1: SharkPup-System (MTR_PWR.1), M1 (C1_M1.1 R1_M1.2 U1_M1.4 U1_M1.11), M2 (C1_M2.1 R1_M2.2 U1_M2.4 U1_M2.11)
+12VCC2: SharkPup-System (5 pins), MOSFETs and Driver (10 pins)
GND: SharkPup-System (21 pins), M1 (17 pins), M2 (17 pins), TC1 (C22_TC1.1 U4_TC1.1), TC2 (C22_TC2.1 U4_TC2.1), MOSFETs and Driver (17 pins), MCU MKL05 QFN24 (11 pins)
DIR1: SharkPup-System (P2.11), M1 (TP6_M1.1 U1_M1.20)
DIR2: SharkPup-System (P2.12), M2 (TP6_M2.1 U1_M2.20)
EN1: SharkPup-System (P2.9), M1 (TP2_M1.1 U1_M1.21)
EN2: SharkPup-System (P2.10), M2 (TP2_M2.1 U1_M2.21)
EXP_CS2: SharkPup-System (P3.5), MCU MKL05 QFN24 (U2.18)
MISO: SharkPup-System (P3.4), MCU MKL05 QFN24 (U2.16)
MOD0E1: SharkPup-System (P2.1), M1 (TP5_M1.1 U1_M1.24)
MOD0E2: SharkPup-System (P2.2), M2 (TP5_M2.1 U1_M2.24)
MOD1E1: SharkPup-System (P2.3), M1 (TP4_M1.1 U1_M1.25)
MOD1E2: SharkPup-System (P2.5), M2 (TP4_M2.1 U1_M2.25)
MOD2E1: SharkPup-System (P2.4), M1 (TP3_M1.1 U1_M1.26)
MOD2E2: SharkPup-System (P2.6), M2 (TP3_M2.1 U1_M2.26)
MOSI: SharkPup-System (P3.6), MCU MKL05 QFN24 (U2.15)
NetP4_2: SharkPup-System (P4.2 P5.2), MCU MKL05 QFN24 (U2.13)
NetP4_4: SharkPup-System (P4.4 P5.1), MCU MKL05 QFN24 (U2.14)
PWM0: MOSFETs and Driver (TP8.1 U3.2), MCU MKL05 QFN24 (U2.21)
PWM1: MOSFETs and Driver (TP9.1 U3.3), MCU MKL05 QFN24 (U2.20)
PWM2: MOSFETs and Driver (TP10.1 U3.4), MCU MKL05 QFN24 (U2.19)
PWM3: MOSFETs and Driver (TP11.1 U3.5), MCU MKL05 QFN24 (U2.10)
REF1: SharkPup-System (P2.13), M1 (R2_M1.2 TP1_M1.1)
REF2: SharkPup-System (P2.14), M2 (R2_M2.2 TP1_M2.1)
SCLK: SharkPup-System (P3.3), MCU MKL05 QFN24 (U2.17)
STEP1: SharkPup-System (P2.7), M1 (TP7_M1.1 U1_M1.22)
STEP2: SharkPup-System (P2.8), M2 (TP7_M2.1 U1_M2.22)
TC_CS1: SharkPup-System (TP14.1), TC1 (U4_TC1.6), MCU MKL05 QFN24 (U2.7)
TC_CS2: SharkPup-System (TP15.1), TC2 (U4_TC2.6), MCU MKL05 QFN24 (U2.2)
TC_MISO: TC1 (U4_TC1.7), TC2 (U4_TC2.7), MCU MKL05 QFN24 (U2.8)
TC_SCLK: TC1 (U4_TC1.5), TC2 (U4_TC2.5), MCU MKL05 QFN24 (U2.12)